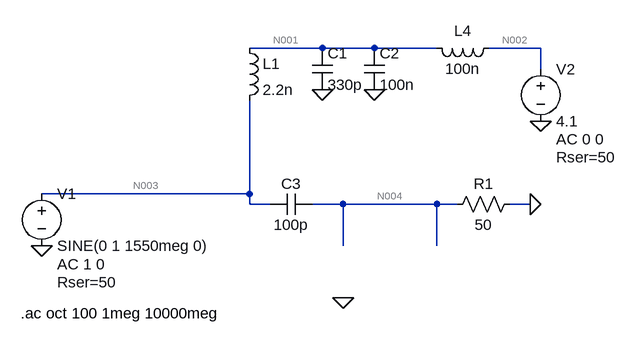
[diagram p0: schematic ACTIVE ANTENNA.asc]
ACTIVE ANTENNA.asc, the LTspice schematic file:
Version 4
SHEET 1 1076 680
WIRE 448 -64 336 -64
WIRE 528 -64 448 -64
WIRE 624 -64 528 -64
WIRE 784 -64 704 -64
WIRE 784 -32 784 -64
WIRE 336 160 336 16
WIRE 336 160 16 160
WIRE 336 176 336 160
WIRE 368 176 336 176
WIRE 480 176 432 176
WIRE 624 176 480 176
WIRE 656 176 624 176
WIRE 768 176 736 176
WIRE 480 240 480 176
WIRE 624 240 624 176
FLAG 16 240 0
FLAG 480 320 0
FLAG 448 0 0
FLAG 528 0 0
FLAG 784 48 0
FLAG 768 176 0
SYMBOL voltage 16 144 R0
WINDOW 123 24 124 Left 2
WINDOW 39 24 152 Left 2
SYMATTR Value2 AC 1 0
SYMATTR SpiceLine Rser=50
SYMATTR InstName V1
SYMATTR Value SINE(0 1 1550meg 0)
SYMBOL ind 320 -80 R0
SYMATTR InstName L1
SYMATTR Value 2.2n
SYMATTR SpiceLine Ipk=0.45 Rser=0.4 Rpar=2563 Cpar=268f mfg="Wurth Elektronik" pn="7447640033 WE-GF 1210"
SYMBOL cap 432 -64 R0
SYMATTR InstName C1
SYMATTR Value 330p
SYMATTR SpiceLine V=6.3 Irms=8.6m Rser=9.56706 Lser=0 mfg="KEMET" pn="C0402C331K9RAC" type="X7R"
SYMBOL cap 512 -64 R0
SYMATTR InstName C2
SYMATTR Value 100n
SYMATTR SpiceLine V=4 Irms=1.62 Rser=0.0464862 Lser=0 mfg="KEMET" pn="C0402C104K7PAC" type="X5R"
SYMBOL ind 720 -80 R90
WINDOW 0 5 56 VBottom 2
WINDOW 3 32 56 VTop 2
SYMATTR InstName L4
SYMATTR Value 100n
SYMBOL cap 432 160 R90
WINDOW 0 0 32 VBottom 2
WINDOW 3 32 32 VTop 2
SYMATTR InstName C3
SYMATTR Value 100p
SYMBOL voltage 784 -48 R0
WINDOW 123 24 124 Left 2
WINDOW 39 24 152 Left 2
SYMATTR Value2 AC 0 0
SYMATTR SpiceLine Rser=50
SYMATTR InstName V2
SYMATTR Value 4.1
SYMBOL res 752 160 R90
WINDOW 0 0 56 VBottom 2
WINDOW 3 32 56 VTop 2
SYMATTR InstName R1
SYMATTR Value 50
TEXT -16 344 Left 2 !.ac oct 100 1meg 10000meg

The netlist it stands for:
* ACTIVE ANTENNA.asc
V1 N003 0 SINE(0 1 1550meg 0) AC 1 0 Rser=50
L1 N001 N003 2.2n Ipk=0.45 Rser=0.4 Rpar=2563 Cpar=268f mfg="Wurth Elektronik" pn="7447640033 WE-GF 1210"
C1 N001 0 330p V=6.3 Irms=8.6m Rser=9.56706 Lser=0 mfg="KEMET" pn="C0402C331K9RAC" type="X7R"
C2 N001 0 100n V=4 Irms=1.62 Rser=0.0464862 Lser=0 mfg="KEMET" pn="C0402C104K7PAC" type="X5R"
L4 N002 N001 100n
C3 N004 N003 100p
V2 N002 0 4.1 AC 0 0 Rser=50
R1 0 N004 50
.ac oct 100 1meg 10000meg
.backanno
.end

* Results of the author's LTspice run, read from the files saved beside the schematic
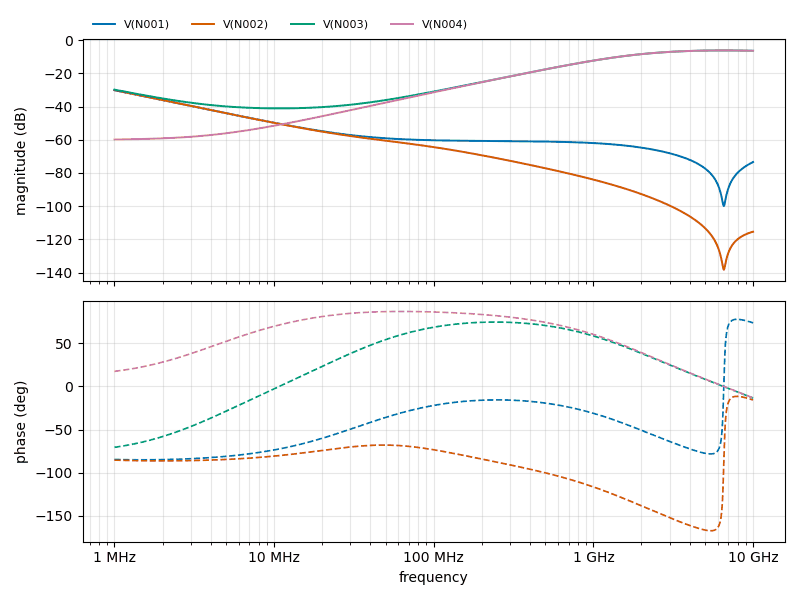
[diagram p1: AC Analysis of ACTIVE ANTENNA.asc, plotted from the saved traces]
* AC Analysis, 1 run:
*   V(N001): -30.08 dB at 1 MHz, -73.39 dB at 10 GHz, peak -30.08 dB at 1 MHz, 3 dB below the peak at 1.416 MHz
*   V(N002): -30.08 dB at 1 MHz, -115.37 dB at 10 GHz, peak -30.08 dB at 1 MHz, 3 dB below the peak at 1.416 MHz
*   V(N003): -29.75 dB at 1 MHz, -6.35 dB at 10 GHz, peak -6.12 dB at 6.562 GHz, 3 dB below the peak at 1.686 GHz
*   V(N004): -59.81 dB at 1 MHz, -6.35 dB at 10 GHz, peak -6.12 dB at 6.562 GHz, 3 dB below the peak at 1.687 GHz